# EAGLE design Pyr0-Piezo_Direct_Extruder_Board2.1.2 (EAGLE 9.5.1)
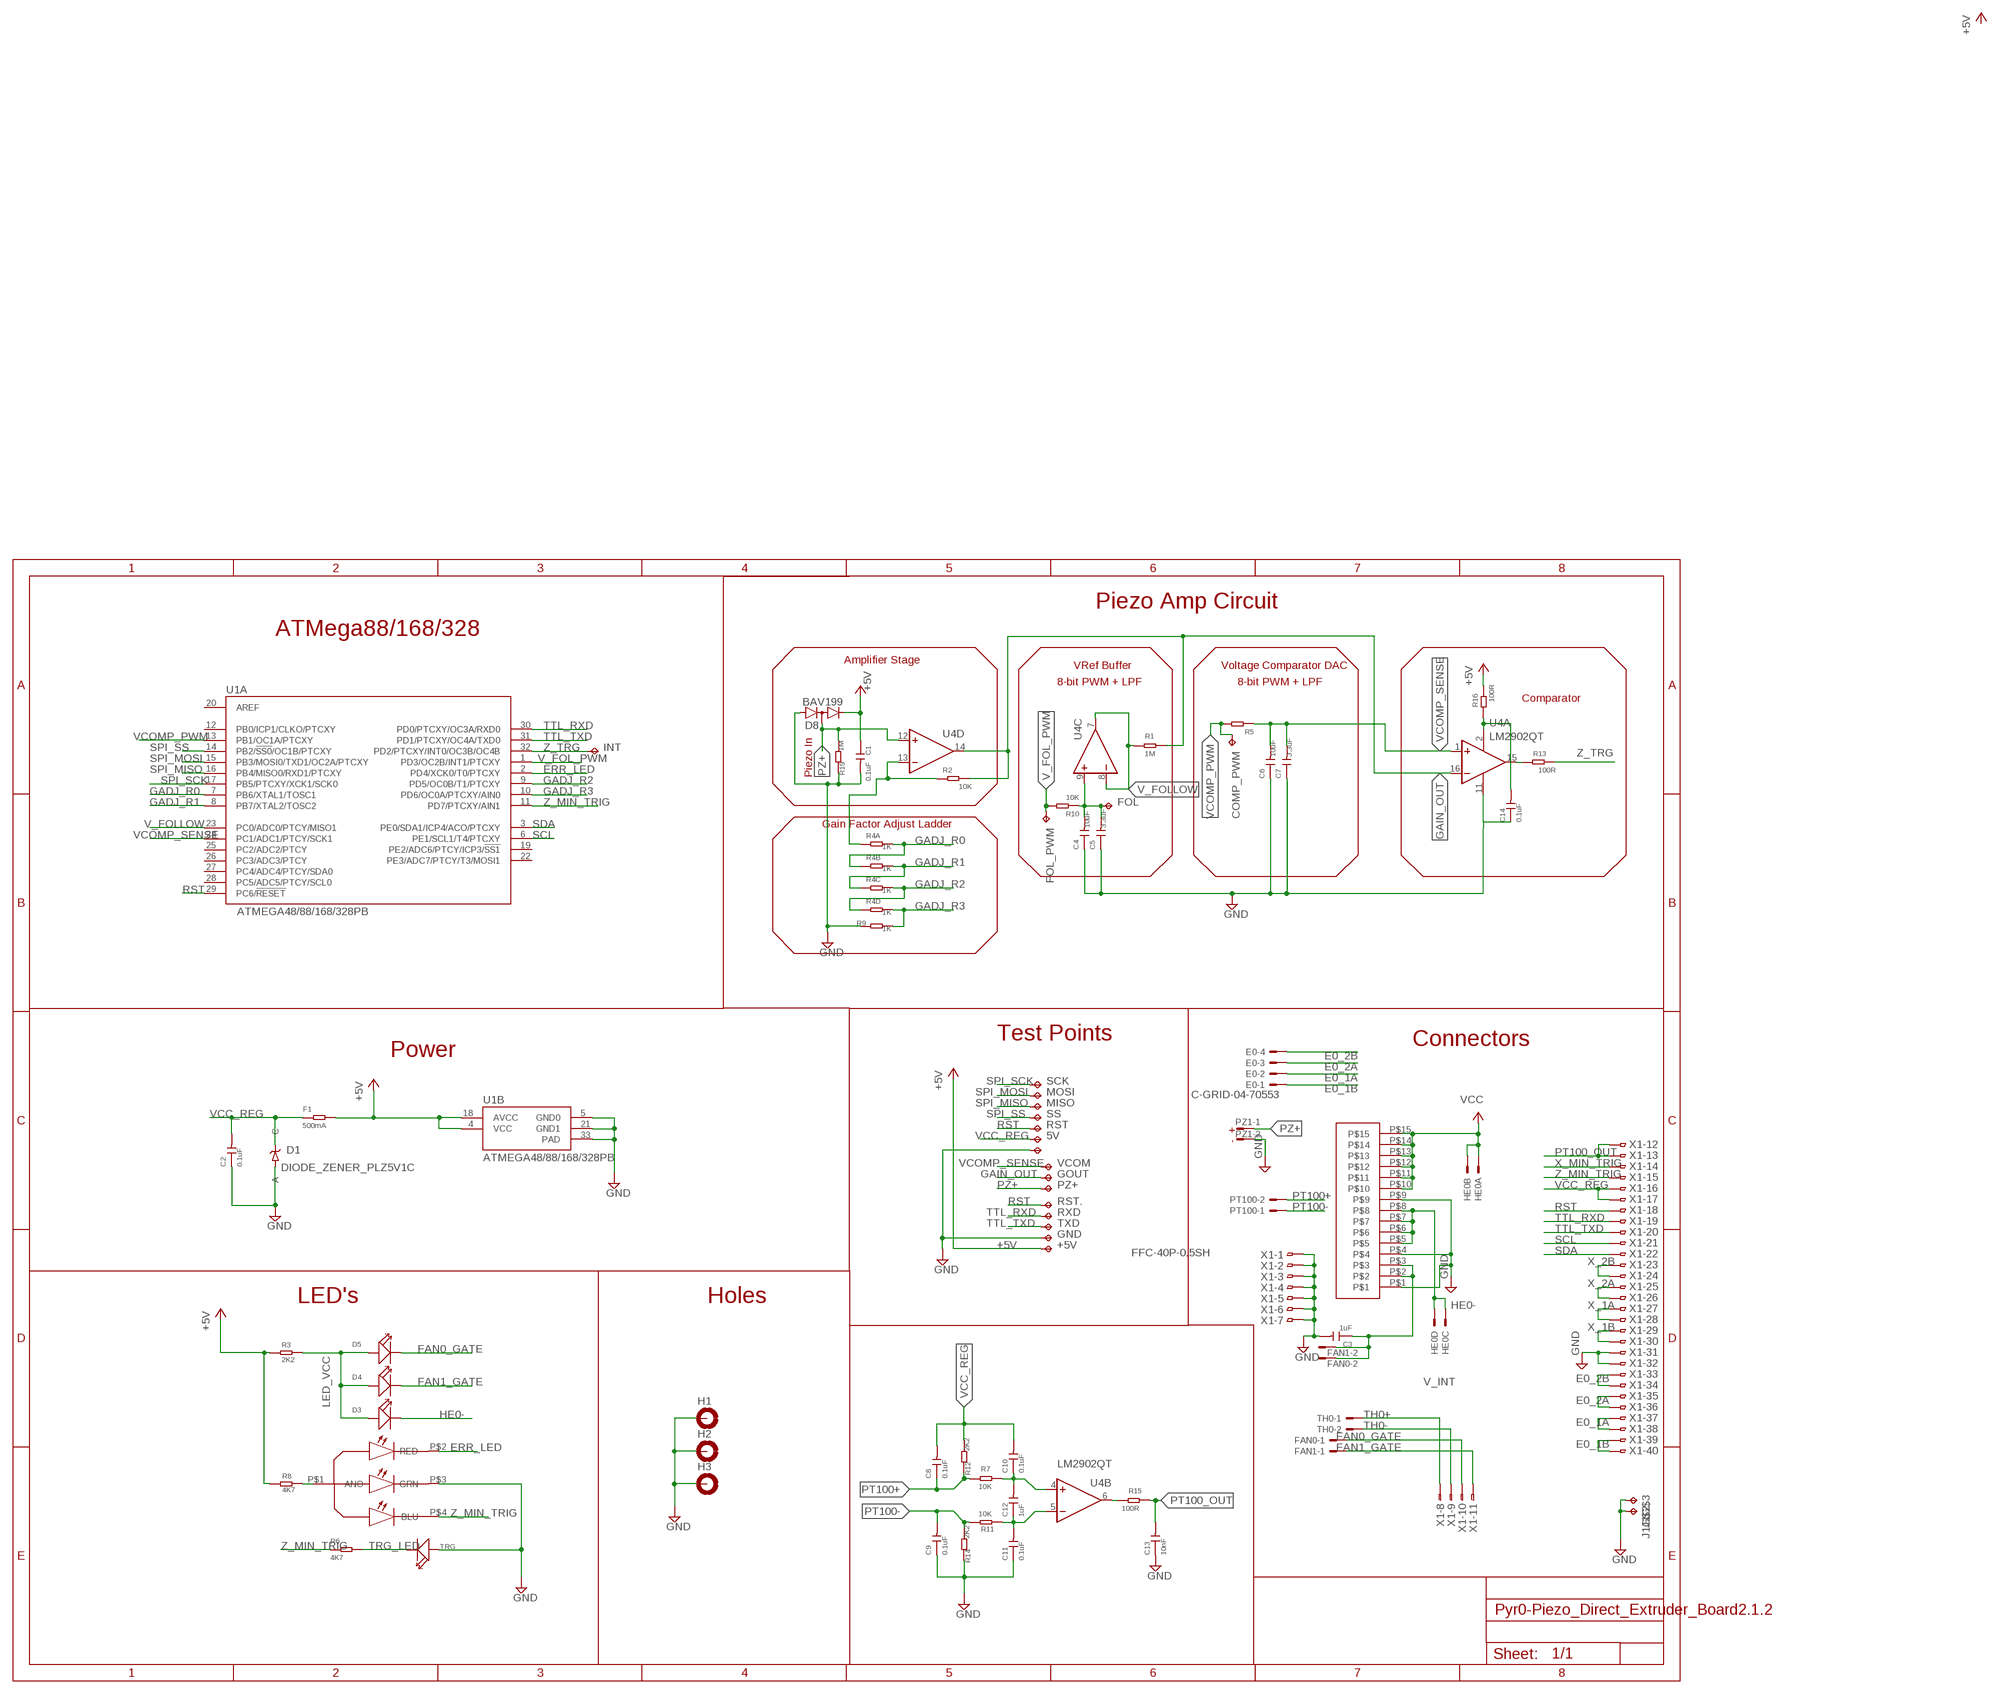
[diagram p0: schematic, sheet 1]

## Parts
5V  TPTP13SQ  [TP13SQ]
+5V  TPTP13SQ  [TP13SQ]
C1  0.1uF  SEEED-CAPACITOR_CERAMIC-10UF-25V-10%-X5R(0805)CAP_0805-3D  [CAPC2012X130]
C2  0.1uF  CERAMIC-1NF-50V-10%-X7R(0402)CAP_0402  [CAPC1005X50]
C3  1uF  SEEED-CAPACITOR_CERAMIC-10UF-25V-10%-X5R(0805)CAP_0603_GEN  [CAPC1609X80]
C4  10uF  CERAMIC-1NF-50V-10%-X7R(0402)CAP_0402  [CAPC1005X50]
C5  3.3uF  SEEED-CAPACITOR_CERAMIC-10UF-25V-10%-X5R(0805)CAP_0603_GEN  [CAPC1609X80]
C6  10uF  CERAMIC-1NF-50V-10%-X7R(0402)CAP_0402  [CAPC1005X50]
C7  3.3uF  SEEED-CAPACITOR_CERAMIC-10UF-25V-10%-X5R(0805)CAP_0603_GEN  [CAPC1609X80]
C8  0.1uF  CERAMIC-1NF-50V-10%-X7R(0402)CAP_0402  [CAPC1005X50]
C9  0.1uF  CERAMIC-1NF-50V-10%-X7R(0402)CAP_0402  [CAPC1005X50]
C10  0.1uF  CERAMIC-1NF-50V-10%-X7R(0402)CAP_0402  [CAPC1005X50]
C11  0.1uF  CERAMIC-1NF-50V-10%-X7R(0402)CAP_0402  [CAPC1005X50]
C12  1uF  CERAMIC-1NF-50V-10%-X7R(0402)CAP_0402  [CAPC1005X50]
C13  10nF  CERAMIC-1NF-50V-10%-X7R(0402)CAP_0402  [CAPC1005X50]
C14  0.1uF  CERAMIC-1NF-50V-10%-X7R(0402)CAP_0402  [CAPC1005X50]
COMP_PWM  TPTP09R  [TP09R]
D1  DIODE_ZENER_PLZ5V1C  [DO-219AC]
D2  LED-RGB-COM_ANO4PLCC  [4PLCC]
D3  SEEED-LED_SMD-LED-CLEAR-BLUE(0603)LED_0603  [SEEED-LED_LED-0603]
D4  SEEED-LED_SMD-LED-CLEAR-BLUE(0603)LED_0603  [SEEED-LED_LED-0603]
D5  SEEED-LED_SMD-LED-CLEAR-BLUE(0603)LED_0603  [SEEED-LED_LED-0603]
D8  BAV199  [SOT23]
E0  C-GRID-04-70553  [70553-04]
F1  500mA  SEEED-RESISTOR_SMD-RES-1.5K-1%-1/10W(0603)DETAILED_MODEL  [SEEED-RESISTOR_R0603]
FAN0  CON-MOLEX-2P-1.27MM048  [53048-02]
FAN1  CON-MOLEX-2P-1.27MM048  [53048-02]
FOL  TPTP13SQ  [TP13SQ]
FOL_PWM  TPTP09R  [TP09R]
GND  TPTP13SQ  [TP13SQ]
GOUT  TPTP13SQ  [TP13SQ]
H1  HOLES_MOUNT-PAD-ROUND3.2  [HOLES_3,2-PAD]
H2  HOLES_MOUNT-PAD-ROUND3.2  [HOLES_3,2-PAD]
H3  HOLES_MOUNT-PAD-ROUND3.2  [HOLES_3,2-PAD]
HE0  JST-2.54-2X2JST-DUPONT-2.54-2X2  [HDRRAR4W64P254_2X2_556X736X556B]
INT  TPTP13R  [TP13R]
J1  FFC-15P-1MM  [FFC-15P-1MM]
MISO  TPTP13SQ  [TP13SQ]
MOSI  TPTP13SQ  [TP13SQ]
PT100  CON-MOLEX-2P-1.27MM048  [53048-02]
PZ1  CON-MOLEX-2P-1.27MM048  [53048-02]
PZ+  TPTP13SQ  [TP13SQ]
R1  1M  SMD-RES-0R-5%-1/16W(0402)  [R0402]
R2  10K  SMD-RES-0R-5%-1/16W(0402)  [R0402]
R3  2K2  SMD-RES-0R-5%-1/16W(0402)  [R0402]
R4  1K  RESISTOR_NETWORK_X40804  [EXBN8V]
R5  0R  SMD-RES-0R-5%-1/16W(0402)  [R0402]
R6  4K7  SMD-RES-0R-5%-1/16W(0402)  [R0402]
R7  10K  SMD-RES-0R-5%-1/16W(0402)  [R0402]
R8  4K7  SMD-RES-0R-5%-1/16W(0402)  [R0402]
R9  1K  SMD-RES-0R-5%-1/16W(0402)  [R0402]
R10  10K  SMD-RES-0R-5%-1/16W(0402)  [R0402]
R11  10K  SMD-RES-0R-5%-1/16W(0402)  [R0402]
R12  2K2  SMD-RES-0R-5%-1/16W(0402)  [R0402]
R13  100R  SMD-RES-0R-5%-1/16W(0402)  [R0402]
R14  2K2  SMD-RES-0R-5%-1/16W(0402)  [R0402]
R15  100R  SMD-RES-0R-5%-1/16W(0402)  [R0402]
R16  100R  SMD-RES-0R-5%-1/16W(0402)  [R0402]
R19  1M  SMD-RES-0R-5%-1/16W(0402)  [R0402]
RST  TPTP13SQ  [TP13SQ]
RST.  TPTP13SQ  [TP13SQ]
RXD  TPTP13SQ  [TP13SQ]
SCK  TPTP13SQ  [TP13SQ]
SS  TPTP06R  [TP06R]
TH0  CON-MOLEX-2P-1.27MM048  [53048-02]
TRG  SEEED-LED_SMD-LED-CLEAR-BLUE(0603)LED_0603  [SEEED-LED_LED-0603]
TXD  TPTP13SQ  [TP13SQ]
U1  ATMEGA48/88/168/328PB  [QFN50P500X500X90-33N]
U4  LM2902QT  [QFN16]
VCOM  TPTP13SQ  [TP13SQ]
X1  FFC-40P-0.5SH  [FH12-40S-0.5SH]
⏚  TPTP13SQ  [TP13SQ]

## Nets
+5V [Power]: +5V.TP C1.1 D8.2(C) F1.2 R3.1 R8.1 R16.2 U1.4(B:VCC) U1.18(B:AVCC)
COMP_VCC: C14.2 R16.1 U4.2(P:V+)
E0_1A: E0.2 X1.37 X1.38
E0_1B: E0.1 X1.39 X1.40
E0_2A: E0.3 X1.35 X1.36
E0_2B: E0.4 X1.33 X1.34
ERR_LED: D2.P$2(RED) U1.2(A:PD4/XCK0/T0/PTCXY)
FAN0_GATE [Power]: D5.- FAN0.1 X1.10
FAN1_GATE [Power]: D4.- FAN1.1 X1.11
GADJ_R0: R4.2 R4.8 U1.7(A:PB6/XTAL1/TOSC1)
GADJ_R1: R4.3 R4.7 U1.8(A:PB7/XTAL2/TOSC2)
GADJ_R2: R4.4 R4.6 U1.9(A:PD5/OC0B/T1/PTCXY)
GADJ_R3: R4.5 R9.2 U1.10(A:PD6/OC0A/PTCXY/AIN0)
GAIN_FB: R2.1 R4.1 U4.13(D:-IN)
GAIN_OUT: GOUT.TP R1.2 R2.2 U4.14(D:OUT) U4.16(A:-IN)
GND [Power]: C1.2 C2.1 C3.2 C4.1 C5.1 C6.1 C7.1 C9.1 C11.1 C13.1 C14.1 D1.P$1(A) D2.P$3(GRN) D8.1(A) GND.TP H1.B3,2(MOUNT) H2.B3,2(MOUNT) H3.B3,2(MOUNT) J1.P$1 J1.P$4 J1.P$9 J1.P$16(TP) J1.P$17(TP) PZ1.2 R9.1 R14.1 R19.1 TRG.+ U1.5(B:GND0) U1.21(B:GND1) U1.33(B:PAD) U4.11(P:V-) X1.1 X1.2 X1.3 X1.4 X1.5 X1.6 X1.7 X1.31 X1.32 ⏚.TP
HE0-: D3.- HE0.3 HE0.4 J1.P$5 J1.P$6 J1.P$7 J1.P$8
LED_VCC: D3.+ D4.+ D5.+ R3.2
PT100+: C8.1 PT100.2 R7.2 R12.1
PT100-: C9.2 PT100.1 R11.2 R14.2
PT100_AMP+: C10.1 C12.2 R7.1 U4.4(B:+IN)
PT100_AMP-: C11.2 C12.1 R11.1 U4.5(B:-IN)
PT100_OUT: C13.2 R15.1 X1.12 X1.13
PT100_R: R15.2 U4.6(B:OUT)
PZ+: D8.3(AC) PZ1.1 PZ+.TP R19.2 U4.12(D:+IN)
PZ_AMP_OUT: R13.1 U4.15(A:OUT)
RGB_VCC: D2.P$1(ANO) R8.2
RST: RST..TP RST.TP U1.29(A:PC6/!RESET!) X1.18
SCL: U1.6(A:PE1/SCL1/T4/PTCXY) X1.21
SDA: U1.3(A:PE0/SDA1/ICP4/ACO/PTCXY) X1.22
SPI_MISO: MISO.TP U1.16(A:PB4/MISO0/RXD1/PTCXY)
SPI_MOSI: MOSI.TP U1.15(A:PB3/MOSI0/TXD1/OC2A/PTCXY)
SPI_SCK: SCK.TP U1.17(A:PB5/PTCXY/XCK1/SCK0)
SPI_SS: SS.TP U1.14(A:PB2/!SS0!/OC1B/PTCXY)
TH0+: TH0.1 X1.8
TH0-: TH0.2 X1.9
TRG_LED: R6.2 TRG.-
TTL_RXD: RXD.TP U1.30(A:PD0/PTCXY/OC3A/RXD0) X1.19
TTL_TXD: TXD.TP U1.31(A:PD1/PTCXY/OC4A/TXD0) X1.20
V_FOL_PWM: FOL_PWM.TP R10.2 U1.1(A:PD3/OC2B/INT1/PTCXY)
V_FOLLOW: R1.1 U1.23(A:PC0/ADC0/PTCY/MISO1) U4.7(C:OUT) U4.8(C:-IN)
V_INT [Power]: C3.1 FAN0.2 FAN1.2 J1.P$2 J1.P$3
VCC [Power]: HE0.1 HE0.2 J1.P$10 J1.P$11 J1.P$12 J1.P$13 J1.P$14 J1.P$15
VCC_REG [Power]: 5V.TP C2.2 C8.2 C10.2 D1.P$2(C) F1.1 R12.2 X1.16 X1.17
VCOMP_PWM: COMP_PWM.TP R5.2 U1.13(A:PB1/OC1A/PTCXY)
VCOMP_SENSE: C6.2 C7.2 R5.1 U1.24(A:PC1/ADC1/PTCY/SCK1) U4.1(A:+IN) VCOM.TP
VREF_IN: C4.2 C5.2 FOL.TP R10.1 U4.9(C:+IN)
X_1A [Power]: X1.27 X1.28
X_1B [Power]: X1.29 X1.30
X_2A [Power]: X1.25 X1.26
X_2B [Power]: X1.23 X1.24
X_MIN_TRIG: X1.14
Z_MIN_TRIG: D2.P$4(BLU) R6.1 U1.11(A:PD7/PTCXY/AIN1) X1.15
Z_TRG: INT.TP R13.2 U1.32(A:PD2/PTCXY/INT0/OC3B/OC4B)
Unconnected: U1.12(A:PB0/ICP1/CLKO/PTCXY) U1.19(A:PE2/ADC6/PTCY/ICP3/!SS1!) U1.20(A:AREF) U1.22(A:PE3/ADC7/PTCY/T3/MOSI1) U1.25(A:PC2/ADC2/PTCY) U1.26(A:PC3/ADC3/PTCY) U1.27(A:PC4/ADC4/PTCY/SDA0) U1.28(A:PC5/ADC5/PTCY/SCL0)

## Notes on the sheet
- Piezo Amp Circuit
- ATMega88/168/328
- Amplifier Stage
- VRef Buffer | Voltage Comparator DAC
- 8-bit PWM + LPF | 8-bit PWM + LPF
- Comparator
- Piezo In
- Gain Factor Adjust Ladder
- Test Points | Connectors
- Power
- -  +
- LED's | Holes

## Library data of the parts
5V COMP_PWM FOL FOL_PWM GOUT INT MISO MOSI PZ+ RST SCK VCOM = PiezoFFC:TP: Test pad
+5V GND RST. RXD SS TXD ⏚ = testpad:TP: Test pad
C1 C3 C5 C7 = PiezoFFC:SEEED-CAPACITOR_CERAMIC-10UF-25V-10%-X5R(0805): 302010178
C2 C4 C6 C8-C14 = PiezoFFC:CERAMIC-1NF-50V-10%-X7R(0402): 302010005
D1 = PiezoFFC:DIODE_ZENER_PLZ5V1C
D2 = PiezoFFC:LED-RGB-COM_ANO: Everlight Electronics Co Ltd EAST1616RGBB4 0606 RGB LED Color: RGB Lens Transparency: Clear Lens Style/Size: Rectangle with Flat top, 1.10 x 1.5 mm mC Rating45mcd Red, 35 mcd Green Current: 5mA Red, 5mA Green, 5mA Forward Voltage: 2V Red, 2V Green Packages: 0606 SparkFun Products: Electric Imp imp002 Breakout <[https://www.sparkfun.com/products/12958]>
D3-D5 TRG = PiezoFFC:SEEED-LED_SMD-LED-CLEAR-BLUE(0603): 304090045
D8 = PiezoFFC:BAV199: DIODE low-leakage double diode
E0 = PiezoFFC:C-GRID-04: CONNECTOR wire to board 2.54 mm (0.100") pitch header; MF: MOLEX; OC_FARNELL: unknown; OC_NEWARK: unknown
F1 = PiezoFFC:SEEED-RESISTOR_SMD-RES-1.5K-1%-1/10W(0603): 301010189
FAN0 FAN1 PT100 PZ1 TH0 = PiezoFFC:CON-MOLEX-2P-1.27MM: CONNECTOR wire to board 1.25 mm (.049 inch) pitch header; MF: MOLEX; MPN: 53048-0210; OC_FARNELL: 1012259; OC_NEWARK: 57H4718
H1-H3 = PiezoFFC:HOLES_MOUNT-PAD-ROUND: MOUNTING PAD, round
HE0 = PiezoFFC:JST-2.54-2X2
J1 = PiezoFFC:FFC-15P-1MM
R1-R3 R6-R16 R19 = PiezoFFC:SMD-RES-0R-5%-1/16W(0402): 301010000; MPN: RC0402JR-070RL; VALUE: 0R
R4 = PiezoFFC:RESISTOR_NETWORK_X4
R5 = PiezoFFC:SMD-RES-0R-5%-1/16W(0402): 301010000; MPN: RC0402JR-070RL
U1 = PiezoFFC:ATMEGA48/88/168/328PB: AVR 32KBytes Flash, 1KBytes EEPROM, 2KBytes RAM, w - 20MHZ, QFN/MFL, IND TEMP, GREEN 5 V/ DFN/QFN (M); AVAILABILITY: Unavailable; DESCRIPTION: AVR 32KBytes Flash, 1KBytes EEPROM, 2KBytes RAM, w - 20MHZ, QFN/MFL, IND TEMP, GREEN 5 V/ DFN/QFN _M_; MF: Microchip; MP: ATMEGA328PB-MU; PACKAGE: VFQFN-32 Microchip; PRICE: None
U4 = PiezoFFC:LM2902: Low power quad operational amplifier Source: Data sgeet <http://www.st.com/internet/com/TECHNICAL_RESOURCES/TECHNICAL_LITERATURE/DATASHEET/CD00000533.pdf>
X1 = PiezoFFC:FFC-40P-0.5S: 0.5mm Pitch Connectors For FPC/FFC Source: Data sheet <http://www.hirose.co.jp/cataloge_hp/e58605370.pdf>; MPN: FH12-40S-0.5SH(55); OC_FARNELL: 1324556; OC_NEWARK: 34M6178

## Board
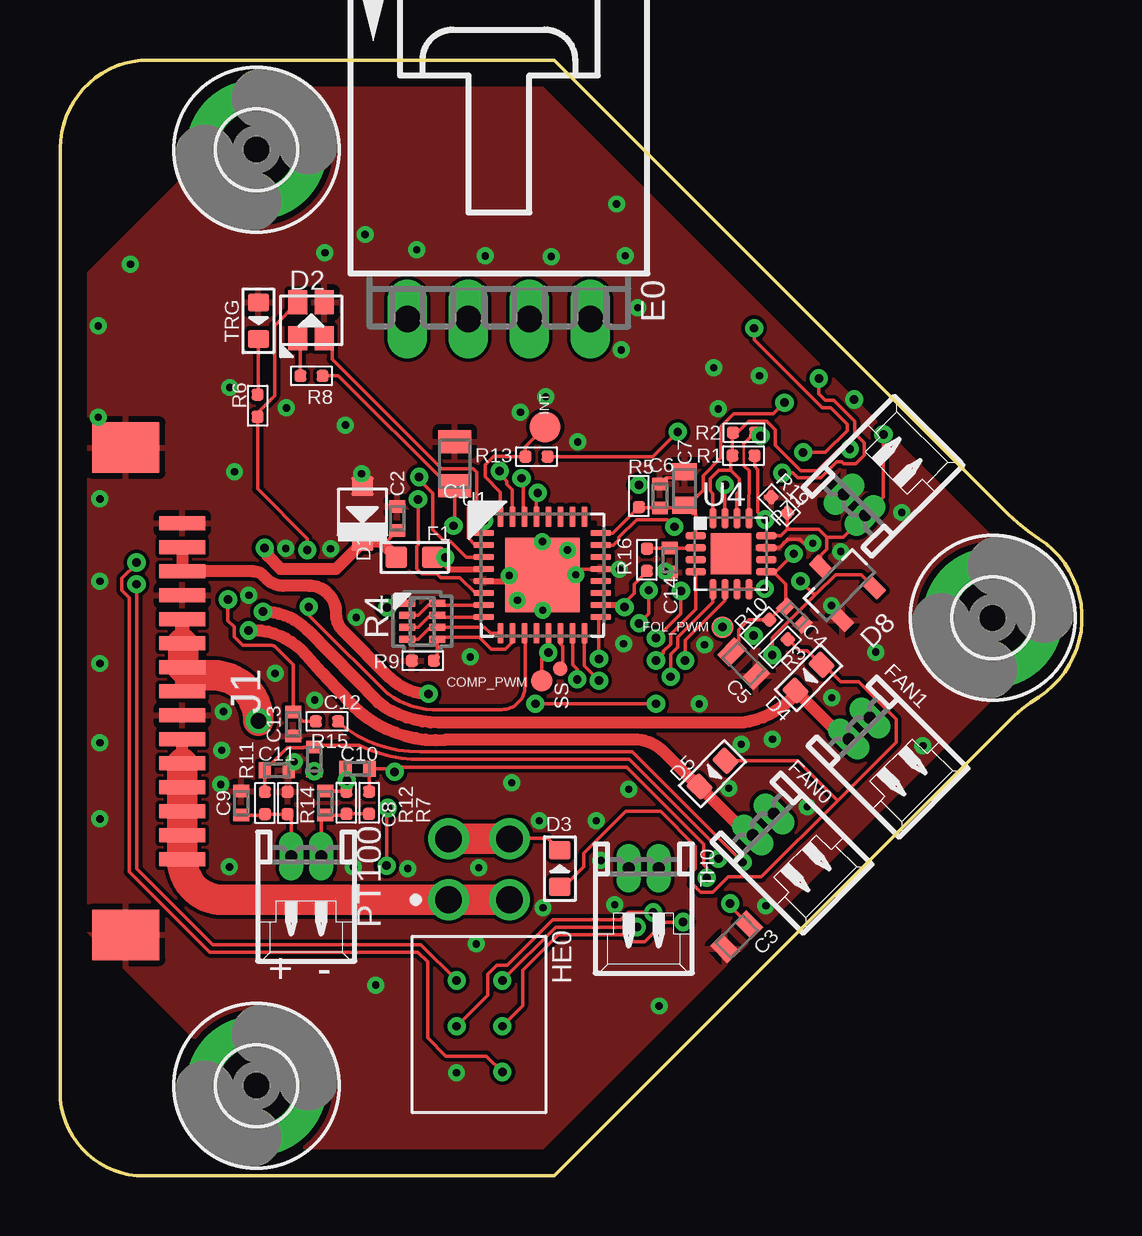
[diagram p1: board, top side]
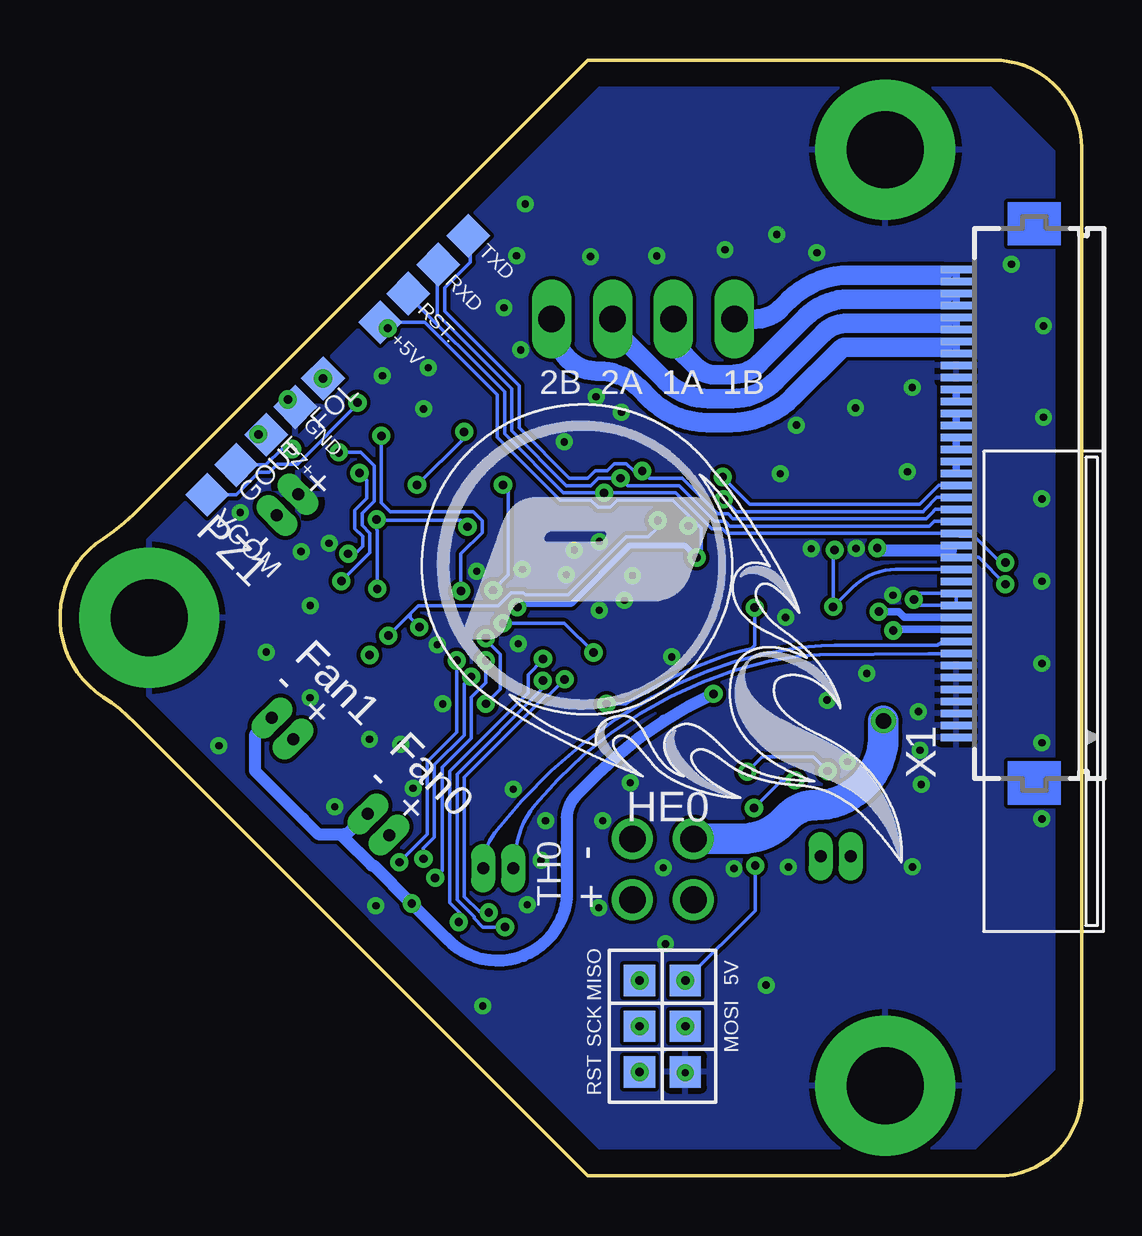
[diagram p2: board, bottom side, seen from below]

Size 42.58 x 46.48 mm. Coordinates in mm from the lower left corner, seen from the top.
Outline: 22.46,1.87 39.46,18.87 arc-12 40.78,19.94 arc114 40.78,26.54 arc-12 39.51,27.56 20.59,46.48 8.14,46.48 3.7,46.48 arc90 0.01,42.8 0.01,3.81 arc90 3.19,0 8.27,0 20.59,0 22.46,1.87
Copper layers (1*16): Top 0.035mm / dielectric 1.5mm / Bottom 0.035mm
Design rules "default *": minimum track width 6mil, minimum drill 0.35mm, track to track 6mil, track to pad 6mil, pad to pad 6mil, via to via 6mil, smd to smd 6mil, copper to edge 40mil, drill to drill 6mil, minimum pad ring 10mil, minimum via ring 8mil, stop-mask expansion 4mil, vias tented up to drill 4mm, thermal gap 10mil

### Footprints (pad centres in the part's own frame; a part is rotated, then mirrored left to right if it is on the bottom)
TP13SQ = smd 1.3 x 1.3: TP 0,0
CAPC2012X130 = smd 0.962 x 1.362: 1 -0.925,0; 2 0.925,0
CAPC1005X50 = smd 0.512 x 0.662: 1 -0.5,0; 2 0.5,0
CAPC1609X80 = smd 0.712 x 1.012: 1 -0.7,0; 2 0.7,0
TP09R = smd 0.9 x 0.9: TP 0,0
DO-219AC = smd 0.8 x 0.9: P$1 -1.15,0; P$2 1.15,0
4PLCC = smd 1 x 0.8: P$1 -0.75,0.55; P$2 -0.75,-0.55; P$3 0.75,-0.55; P$4 0.75,0.55
SEEED-LED_LED-0603 = smd 0.762 x 0.889: + -0.762,0; - 0.762,0
SOT23 = smd 0.6 x 0.9: 1 -0.95,-1.1; 2 0.95,-1.1; 3 0,1.1
70553-04 = drill 1.092 long: 1 -3.81,-7.62; 2 -1.27,-7.62; 3 1.27,-7.62; 4 3.81,-7.62
SEEED-RESISTOR_R0603 = smd 0.889 x 0.889: 1 0,0.762; 2 0,-0.762
53048-02 = drill 0.5 pad 0.698 long: 1 0.625,-1.25; 2 -0.625,-1.25
HOLES_3,2-PAD = drill 3.2 pad 5.842: B3,2 0,0
HDRRAR4W64P254_2X2_556X736X556B = drill 1.105 pad 1.705: 1 0,0; 2 2.54,0; 3 2.54,2.54; 4 0,2.54
TP13R = smd 1.3 x 1.3: TP 0,0
FFC-15P-1MM = smd 0.6 x 1.9: P$1 0,0; P$2 1,0; P$3 2,0; P$4 3,0; P$5 4,0; P$6 5,0; P$7 6,0; P$8 7,0; P$9 8,0; P$10 9,0; P$11 10,0; P$12 11,0; P$13 12,0; P$14 13,0; P$15 14,0 | smd 2.1 x 2.8: P$16 -3.15,-2.35; P$17 17.15,-2.35
R0402 = smd 0.5 x 0.5: 1 0,0.463; 2 0,-0.463
EXBN8V = smd 0.657 x 0.3: 1 -0.629,0.75; 2 -0.629,0.25; 3 -0.629,-0.25; 4 -0.629,-0.75; 5 0.629,-0.75; 6 0.629,-0.25; 7 0.629,0.25; 8 0.629,0.75
TP06R = smd 0.6 x 0.6: TP 0,0
QFN50P500X500X90-33N = smd 0.86 x 0.26: 1 -2.435,1.75; 2 -2.435,1.25; 3 -2.435,0.75; 4 -2.435,0.25; 5 -2.435,-0.25; 6 -2.435,-0.75; 7 -2.435,-1.25; 8 -2.435,-1.75; 17 2.435,-1.75; 18 2.435,-1.25; 19 2.435,-0.75; 20 2.435,-0.25; 21 2.435,0.25; 22 2.435,0.75; 23 2.435,1.25; 24 2.435,1.75 | smd 0.26 x 0.86: 9 -1.75,-2.435; 10 -1.25,-2.435; 11 -0.75,-2.435; 12 -0.25,-2.435; 13 0.25,-2.435; 14 0.75,-2.435; 15 1.25,-2.435; 16 1.75,-2.435; 25 1.75,2.435; 26 1.25,2.435; 27 0.75,2.435; 28 0.25,2.435; 29 -0.25,2.435; 30 -0.75,2.435; 31 -1.25,2.435; 32 -1.75,2.435 | smd 3.1 x 3.1: 33 0,0
QFN16 = smd 0.85 x 0.3: 1 -1.475,0.75; 2 -1.475,0.25; 3 -1.475,-0.25; 4 -1.475,-0.75; 9 1.475,-0.75; 10 1.475,-0.25; 11 1.475,0.25; 12 1.475,0.75 | smd 0.3 x 0.85: 5 -0.75,-1.475; 6 -0.25,-1.475; 7 0.25,-1.475; 8 0.75,-1.475; 13 0.75,1.475; 14 0.25,1.475; 15 -0.25,1.475; 16 -0.75,1.475 | smd 1.7 x 1.7: TH 0,0
FH12-40S-0.5SH = smd 0.3 x 1.3: 1 -9.75,3.25; 2 -9.25,3.25; 3 -8.75,3.25; 4 -8.25,3.25; 5 -7.75,3.25; 6 -7.25,3.25; 7 -6.75,3.25; 8 -6.25,3.25; 9 -5.75,3.25; 10 -5.25,3.25; 11 -4.75,3.25; 12 -4.25,3.25; 13 -3.75,3.25; 14 -3.25,3.25; 15 -2.75,3.25; 16 -2.25,3.25; 17 -1.75,3.25; 18 -1.25,3.25; 19 -0.75,3.25; 20 -0.25,3.25; 21 0.25,3.25; 22 0.75,3.25; 23 1.25,3.25; 24 1.75,3.25; 25 2.25,3.25; 26 2.75,3.25; 27 3.25,3.25; 28 3.75,3.25; 29 4.25,3.25; 30 4.75,3.25; 31 5.25,3.25; 32 5.75,3.25; 33 6.25,3.25; 34 6.75,3.25; 35 7.25,3.25; 36 7.75,3.25; 37 8.25,3.25; 38 8.75,3.25; 39 9.25,3.25; 40 9.75,3.25

### Placement (x,y rotation side)
5V  16.52,8.13 0 bottom
+5V  29.24,35.56 135 bottom
C1  16.45,29.66 90 top
C2  14.06,27.38 270 top
C3  28.2,9.96 225 top
C4  30.6,23.34 135 top
C5  28.49,21.32 135 top
C6  25,28.32 270 top
C7  26.02,28.62 270 top
C8  11.05,15.52 90 top
C9  7.56,15.52 270 top
C10  12.39,16.95 180 top
C11  9.03,16.89 180 top
C12  10.59,17.35 270 top
C13  9.72,18.82 90 top
C14  25.41,25.65 90 top
COMP_PWM  20.08,20.61 0 top
D1  12.6,27.58 270 top
D2  10.46,35.63 90 top
D3  20.83,12.79 90 top
D4  31.19,20.75 225 top
D5  27.19,16.75 225 top
D8  32.48,24.6 45 top
E0  18.29,43.31 0 top
F1  14.77,25.75 90 top
FAN0  30.19,13.75 225 top
FAN1  34.19,17.75 225 top
FOL  31.62,33.21 225 bottom
FOL_PWM  27.6,22.85 0 top
GND  32.78,32.02 315 bottom
GOUT  35.23,29.61 225 bottom
H1  8.19,3.75 0 top
H2  8.19,42.75 0 top
H3  38.86,23.24 0 top
HE0  16.19,11.49 0 top
INT  20.21,31.19 180 top
J1  5.09,27.18 270 top
MISO  18.43,8.13 0 bottom
MOSI  16.52,6.22 0 bottom
PT100  10.26,12.06 180 top
PZ1  33.99,28.83 315 top
PZ+  33.99,30.86 45 bottom
R1  28.48,30 270 top
R2  28.5,30.95 270 top
R3  30.01,22.02 135 top
R4  15.09,23.09 0 top
R5  24.12,28.32 180 top
R6  8.23,32.08 180 top
R7  12.88,15.53 0 top
R8  10.48,33.32 270 top
R9  15.12,21.46 90 top
R10  29.23,22.83 315 top
R11  8.53,15.52 0 top
R12  11.93,15.53 180 top
R13  19.86,29.96 270 top
R14  9.48,15.52 0 top
R15  11.13,18.92 90 top
R16  24.45,25.66 0 top
R19  29.96,27.94 45 top
RST  18.43,4.32 0 bottom
RST.  28.07,36.75 315 bottom
RXD  26.82,37.96 135 bottom
SCK  18.43,6.22 0 bottom
SS  20.84,21.11 90 top
TH0  24.32,11.56 180 top
TRG  8.27,35.62 270 top
TXD  25.57,39.16 135 bottom
U1  20.1,25.02 0 top
U4  27.95,25.91 0 top
U$1  [LOGO-PYR0BALL-SS-20MM]  20.73,25.51 0 bottom
VCOM  36.45,28.36 45 bottom
X1  1.98,28 90 bottom
⏚  16.52,4.32 0 bottom

### Tracks (layer width: path | path; a pad name or v marks a point on that pad's centre or on a via)
+5V  (via drill 0.35)
  Top 0.15: 29.68,22.41 31.44,24.18
  Top 0.152: 29.68,22.41 R3.1 | D8.2 33.38,25.04 32.33,25.04 31.54,24.25 31.51,24.25 31.44,24.18 v30.85,24.77 | v28.92,35.31 28.92,34.83 31.76,32 32.12,32 32.8,31.31 32.8,31.04 31.89,30.13 v30.96,30.13 | 23.43,23.77 23.92,24.27 23.92,24.64 24.45,25.17 R16.2 | v16.4,27.08 16.45,27.13 C1.1 16.19,28.73 11.6,33.32 R8.1
  Top 0.254: F1.2 15.56,25.73 15.81,25.73 | 15.81,25.73 16.27,25.27 U1.4 | v23.52,23.68 23.43,23.77 U1.18 | v16.05,25.75 16.03,25.73 15.81,25.73
  Bottom 0.152: +5V.TP 28.99,35.31 v28.92,35.31 28.67,35.56 27.39,35.56 24.36,32.53 24.36,30.77 21.73,28.14 20.46,28.14 20.16,27.84 19.65,27.84 19.35,28.14 17.04,28.14 16.3,27.4 | v16.05,25.75 15.86,25.95 15.86,26.96 16.3,27.4 | v16.4,27.08 16.3,27.18 16.3,27.4 | v30.96,30.13 30.05,30.13 29.49,29.57 29.49,28.09 29.99,27.59 29.99,27.09 29.66,26.76 29.66,25.96 v30.85,24.77
  Bottom 0.254: v23.52,23.68 23.37,23.84 21.25,23.84 18.83,26.26 16.55,26.26 v16.05,25.75
  other vias: 29.68,21.69
COMP_VCC
  Top 0.152: U4.2 26.47,26.15 C14.2 24.48,26.15 R16.1
E0_1A
  Bottom 0.305: X1.37 X1.38 arc45 5.79,36.52 5.86,36.52
  Bottom 0.813: E0.2 17.02,35.35 arc-45 16.52,34.16 16.02,33.65 arc-45 15.34,33.37 14.61,33.37 arc-45 13.41,33.87 11.5,35.78 arc45 9.71,36.52 5.86,36.52
E0_1B
  Bottom 0.305: X1.39 X1.40 arc45 5.79,37.52 5.86,37.52
  Bottom 0.813: E0.1 13.61,35.69 arc-45 12.56,36.12 12.22,36.47 arc45 9.67,37.52 5.86,37.52
E0_2A
  Bottom 0.305: X1.35 X1.36 arc45 5.79,35.52 5.81,35.52
  Bottom 0.813: E0.3 arc-45 19.3,35.06 17.35,33.12 arc-45 15.56,32.37 14.56,32.37 arc-45 12.77,33.12 10.78,35.1 arc45 9.76,35.52 5.81,35.52
E0_2B
  Bottom 0.305: X1.33 X1.34 arc45 5.79,34.52 5.81,34.52
  Bottom 0.813: E0.4 E0.4 arc-45 21.41,34.02 arc-45 20.2,33.52 20.16,33.52 arc45 18.45,32.82 18.01,32.37 arc-45 15.6,31.37 14.62,31.37 arc-45 12.04,32.44 10.07,34.41 arc45 9.81,34.52 5.81,34.52
ERR_LED
  Top 0.152: U1.2 17.3,26.27 17.01,26.57 17.01,27.8 17.36,28.16 17.36,29.31 17.23,29.44 15.91,29.44 11.33,34.02 11.33,34.56 D2.P$2
FAN0_GATE  (via drill 0.35)
  Top 0.508: FAN0.1 28.67,14.19 D5.- 26.18,16.64 25.16,17.65 arc50 23.76,18.16 16.08,18.16 arc-49 12.2,19.59 arc-5 10.25,21.69 arc41 8.4,22.71 v7.86,22.71
  Bottom 0.305: v7.86,22.71 7.66,22.71 7.61,22.75 X1.10
FAN1_GATE  (via drill 0.35)
  Top 0.508: FAN1.1 32.67,18.19 D4.- 30.65,20.06 30.46,19.87 arc-37 28.46,18.87 15.77,18.87 arc-37 13.26,19.71 arc1 10.3,22.74 arc45 v8.46,23.5
  Bottom 0.305: v8.46,23.5 7.63,23.5 7.39,23.25 X1.11
GADJ_R0
  Top 0.152: R4.2 14.92,23.34 15.36,23.78 15.66,23.78 R4.8 15.79,23.77 U1.7
GADJ_R1
  Top 0.152: R4.3 14.92,22.84 15.36,23.28 15.66,23.28 R4.7 15.79,23.41 15.92,23.27 U1.8
GADJ_R2
  Top 0.152: R4.4 14.92,22.34 15.36,22.78 15.66,22.78 R4.6 17.69,22.84 17.94,22.59 U1.9
GADJ_R3
  Top 0.152: R9.2 15.72,21.6 R4.5 15.8,22.42 17.47,22.42 17.96,21.93 18.56,21.93 18.85,22.22 U1.10
GAIN_FB  (via drill 0.35)
  Top 0.102: 28.48,29.58 28.48,30.48
  Top 0.152: R4.1 14.4,23.78 13.75,23.78 v13.63,23.66 | U4.13 28.71,29.36 28.48,29.58 | v25.87,24.36 25.87,23.42 24.85,22.39 v24.83,22.39 | v24.83,19.66 v19.81,19.66 | 28.48,30.48 R2.1 29.06,30.95 v29.19,30.82
  Bottom 0.152: v25.87,24.36 25.87,25.9 24.99,26.78 24.99,27.29 25.37,27.66 28.81,27.66 29.19,28.04 v29.19,30.82 | v24.83,22.39 24.83,22.32 24.23,21.71 24.23,20.26 v24.83,19.66 | v19.81,19.66 19.03,19.66 18.92,19.72 18.89,19.75 17.83,20.35 arc9 15.14,21.56 arc8 13.78,21.95 13.63,22.1 v13.63,23.66
GAIN_OUT  (via drill 0.35)
  Top 0.152: 27.96,29.38 27.45,29.38 27.1,29.03 27.1,28.53 27.2,28.42 U4.16 | 27.96,29.38 28.31,29.03 28.31,28.53 28.2,28.42 U4.14 | 27.96,29.38 27.96,29.94 R1.2 28.02,30.93 R2.2 28.21,30.95 28.69,31.43 29.44,31.43 29.79,31.07 29.79,30.44 30.86,29.37 31.56,29.37 32.46,30.27 v32.9,30.27
  Bottom 0.152: v32.9,30.27 33.33,30.27 34,29.61 GOUT.TP
GND  (via drill 0.3, 0.35)
  Top 0.152: U4.11 29.97,26.16 30.32,26.52 30.82,26.52 30.99,26.35 v31.37,26.35 | C7.1 25.78,29.08 25.26,29.08 C6.1 | U1.33 20.35,25.27 U1.21
  Top 0.254: U1.5 19.56,24.77 19.7,24.64 19.71,24.64 U1.33
  other vias: 23.48,22.17 27.43,31.94 23.56,38.33 8.96,20.92 25.21,25.18 35.96,17.91 29.68,18.18 2.94,37.97 35.07,27.63 1.67,28.19 1.67,24.77 1.67,21.34 1.67,18.03 1.67,14.86 13.16,7.94 6.75,17.72 7.87,24.18 11.04,38.45 11.27,26.12 20.24,32.45 19.97,14.78 21.57,30.57 22.35,14.78 14.87,38.58 28.38,17.97 19.06,23.98 31.13,15.37 29.41,11.24 27.87,16.14 12.23,12.86 17.44,12.83 32.54,26 20.47,38.29 27.24,33.65 29.14,33.32 12.56,29.25 32.16,19.91 7.07,32.84 7.27,29.33 33.09,32.33 19.19,31.81 20.11,23.56 32.15,23.75 12.35,23.26 18.72,25 21.49,25.04 21.15,26.06 26.64,19.65 9.41,26.13 26.86,22.12 11.89,31.27 17.09,21.61 23.7,16.1 6.69,16.3 7.06,12.86 17.71,38.32 23.19,40.48 12.71,39.21 33.98,21.81 6.81,19.34 10.62,19.81 24.08,36.16 23.39,34.4 1.6,31.59 1.6,35.4 16.52,4.29 17.35,9.65 22.54,13.13 23.11,11.29 20.12,11.16 18.82,16.37 24.96,7.07 14.49,12.79 20.1,26.42 9.43,31.98 9.77,17.24 23.31,25.26
  pour Top (rank 6): 1.01,37.43 1.01,10.32 10.46,0.87 20.46,0.87 39.46,19.87 39.46,26.87 20.46,45.87 9.46,45.87
  pour Bottom (rank 6): 1.01,42.51 1.01,4.6 4.47,1.14 20.08,1.14 39.26,20.32 39.26,26.16 20.08,45.34 3.84,45.34
  cutout Top: 18.06,27.22 22.31,27.22 22.31,23.07 22.31,22.8 18.18,22.8 17.86,22.8 17.86,27.22
HE0-  (via drill 0.65)
  Top 0.152: D3.- 20.32,14.06 18.76,14.06 HE0.3
  Top 0.61: J1.P$6 J1.P$5 | J1.P$7 J1.P$8
  Top 1.27: HE0.3 HE0.4 | v8.27,18.95 arc90 6.37,20.85 5.43,20.85 5.13,21.15 | 5.13,21.15 J1.P$7 | J1.P$6 5.13,22.15 5.13,21.15
  Bottom 1.27: HE0.4 14.21,14.03 arc-45 12.42,14.78 12.21,14.98 arc45 11.13,15.43 arc-90 8.27,18.29 v8.27,18.95
LED_VCC
  Top 0.152: D5.+ 30.74,17.29 32.4,15.62 | 32.4,15.62 34.84,18.06 34.84,19.02 33.28,20.57 32.53,20.57 31.82,21.29 D4.+ 31.14,21.87 30.81,21.87 R3.2 | 32.4,15.62 29.22,12.45 27.85,12.45 27.2,11.8 26.7,11.8 26.34,12.15 26.34,12.65 26.47,12.79 26.47,13.73 25.02,15.18 23.57,15.18 21.83,13.43 21.83,12.86 21,12.03 D3.+
PT100+
  Top 0.152: R7.2 R12.1 11.87,15.02 C8.1 11.02,15.05 10.88,14.91 PT100.2
PT100-
  Top 0.152: C9.2 8.49,15.02 R11.2 R14.2 9.63,14.91 PT100.1
PT100_AMP+  (via drill 0.35)
  Top 0.152: v26.95,12.4 26.95,12.83 26.83,12.95 26.83,13.81 23.61,17.02 14.14,17.02 v13.95,16.82 13.82,16.95 C10.1 12.89,16.01 R7.1 | U4.4 26.48,23.59 25.44,22.55 25.44,22.14 25.14,21.84 25.14,21.77 v24.84,21.46
  Bottom 0.152: v26.95,12.4 26.65,12.7 26.65,17.01 25.44,18.22 25.44,19.93 24.84,20.53 v24.84,21.46 | v13.95,16.82 13.31,17.45 11.19,17.45 C12.2
  other vias: 10.59,16.85
PT100_AMP-  (via drill 0.35)
  Top 0.152: v27.43,13.2 27.43,13.63 23.72,17.35 16.38,17.35 arc0 14.67,17.35 arc-22 12.47,17.92 10.66,17.92 C12.1 10.16,17.85 10.14,17.83 9.47,17.83 C11.2 R11.1 | U4.5 27.2,23.89 25.74,22.43 25.74,22.02 25.44,21.71 v25.44,20.79
  Bottom 0.152: v27.43,13.2 27.43,13.63 26.98,14.09 26.98,17.11 25.74,18.34 25.74,20.48 v25.44,20.79
PT100_OUT  (via drill 0.35)
  Top 0.152: v7,24 7,23.11 7.25,22.86 7.25,22.46 7.61,22.1 8.82,22.1 8.95,22.06 9.72,21.29 C13.2 10.11,18.92 R15.1
  Bottom 0.152: v7,24 6.75,23.75 X1.12 X1.13 6.75,24.25 v7,24
PT100_R  (via drill 0.35)
  Top 0.152: v28.44,13.06 23.84,17.65 15,17.65 arc-39 11.64,18.84 11.64,18.88 R15.2 | U4.6 27.71,23.96 26.05,22.3 v26.05,21.46
  Bottom 0.152: v28.44,13.06 27.28,14.21 27.28,17.24 26.05,18.47 v26.05,21.46
PZ+  (via drill 0.35)
  Top 0.152: v34.31,30.89 34.31,28.27 PZ1.1 32.63,26.59 31.95,26.59 | 31.95,26.59 31.95,26.11 31.7,25.86 D8.3 | 31.95,26.59 31.61,26.93 30.3,26.93 | U4.12 30.03,26.66 30.3,26.93 | R19.2 30.3,27.6 30.3,26.93
  Bottom 0.152: PZ+.TP 34.01,30.89 v34.31,30.89
PZ_AMP_OUT  (via drill 0.35)
  Top 0.152: U4.15 v27.7,28.78 | v25.74,30.99 24.71,29.96 R13.1
  Bottom 0.152: v27.7,28.78 27.69,28.78 25.74,30.72 v25.74,30.99
RGB_VCC
  Top 0.152: D2.P$1 10.02,34.78 R8.2
RST  (via drill 0.35)
  Top 0.152: RST.TP 17.77,4.98 16.08,4.98 15.32,5.75 15.32,8.9 14.91,9.31 6.24,9.31 2.88,12.66 2.88,24.09 2.58,24.39 2.58,24.89 3.19,25.5 v3.19,25.55 | v19.91,28.45 19.85,28.39 U1.29
  Bottom 0.152: RST..TP 28.07,36.67 24.06,32.66 24.06,30.9 21.6,28.45 v19.91,28.45 16.91,28.45 15.42,26.96 14.99,26.96 14.79,26.75 X1.18 5.11,26.64 4.49,26.64 3.4,25.55 v3.19,25.55
  other vias: 18.43,4.32
SCL  (via drill 0.35)
  Top 0.152: U1.6 17.3,24.27 16.66,24.92 15.87,24.92 15.71,25.08 15.06,25.08 14.86,25.28 14.86,26.23 14.92,26.28 v14.92,28.17
  Bottom 0.152: X1.21 6.04,28.25 6.54,27.75 6.54,27.74 6.62,27.67 14.41,27.67 v14.92,28.17
SDA  (via drill 0.35)
  Top 0.152: U1.3 16.92,25.77 16.28,26.41 16.02,26.41 15.52,26.91 15.52,28.42 14.96,28.98 v14.96,29.1
  Bottom 0.152: X1.22 5.97,28.75 6.75,27.97 13.83,27.97 v14.96,29.1
SPI_MISO  (via drill 0.35)
  Top 0.152: v24.04,10.36 20.66,10.36 MISO.TP | v22.46,20.62 21.85,21.23 U1.16
  Bottom 0.152: v24.04,10.36 24.97,10.36 25.32,10.71 25.32,10.78 26.04,11.49 26.04,16.72 22.46,20.3 v22.46,20.62
  other vias: 18.43,8.13
SPI_MOSI  (via drill 0.35)
  Top 0.152: v24.72,10.96 23.68,10.96 23.38,10.66 20.53,10.66 18.63,8.76 18.21,8.76 17.82,8.38 17.82,7.52 MOSI.TP | v21.55,20.67 21.55,21.1 21.37,21.29 21.37,22.57 U1.15
  Bottom 0.152: v24.72,10.96 24.72,10.99 25.1,10.99 25.73,11.62 25.73,16.59 22.31,20.02 22.21,20.02 v21.55,20.67
  other vias: 16.52,6.22
SPI_SCK  (via drill 0.35)
  Top 0.152: v25.96,10.56 25.17,10.56 24.36,9.75 23.79,9.75 23.51,10.03 20.76,10.03 19.28,8.55 19.28,7.07 SCK.TP | v22.46,21.53 22.46,23.2 U1.17
  Bottom 0.152: v25.96,10.56 25.91,10.62 25.91,10.93 26.34,11.37 26.34,16.85 23.07,20.12 23.07,20.87 22.46,21.48 v22.46,21.53
  other vias: 18.43,6.22
SPI_SS
  Top 0.152: U1.14 20.85,22.16 20.96,22.05 20.96,21.23 SS.TP
TH0+
  Bottom 0.152: TH0.1 23.57,13.65 arc31 22.79,15.42 arc38 13.05,21.43 arc11 10.92,21.7 6.39,21.73 5.25,21.73 X1.8
TH0-
  Bottom 0.152: TH0.2 arc39 24.46,14.29 arc23 17.91,19.94 arc21 11.95,21.98 arc8 10.3,22.1 6.01,22.1 5.98,22.13 5.95,22.13 5.83,22.25 X1.9
TRG_LED
  Top 0.152: TRG.- 8.27,32.58 R6.2
TTL_RXD  (via drill 0.35)
  Top 0.152: v19.23,29.05 19.23,28.92 19.3,28.85 19.3,27.51 U1.30
  Bottom 0.152: RXD.TP 26.86,37.92 26.86,35.89 23.75,32.78 23.75,31.03 21.48,28.75 20.46,28.75 20.16,29.05 v19.23,29.05 18.93,28.75 16.79,28.75 15.29,27.26 14.87,27.26 14.66,27.06 6.36,27.06 6.16,27.25 X1.19
TTL_TXD  (via drill 0.35)
  Top 0.152: v18.32,29.36 18.32,29.23 18.62,28.93 18.62,28.8 18.85,28.58 U1.31
  Bottom 0.152: TXD.TP 25.48,39.07 25.48,38.06 26.55,36.98 26.55,36.02 23.45,32.91 23.45,31.15 21.35,29.06 20.59,29.06 20.28,29.36 19.78,29.36 19.48,29.66 18.98,29.66 18.67,29.36 v18.32,29.36 18.02,29.06 16.66,29.06 15.17,27.57 14.74,27.57 14.54,27.36 6.49,27.36 6.24,27.62 6.11,27.75 X1.20
V_FOL_PWM  (via drill 0.35)
  Top 0.152: U1.1 17.66,27.28 v17.67,27.29
  Bottom 0.152: v17.67,27.29 17.67,27 18.06,26.61 18.98,26.61 21.4,24.19 23.17,24.19 23.27,24.29 23.77,24.29 24.31,23.75 27.65,23.75 27.99,23.41 | 27.99,23.41 R10.2 | FOL_PWM.TP 27.99,23.24 27.99,23.41
  other vias: 28.9,22.5 27.6,22.85
V_FOLLOW  (via drill 0.35)
  Top 0.152: U4.7 U4.8 29.34,24.43 v29.36,24.45 | v29.39,27.34 29.08,27.64 29.08,29.42 28.94,29.55 R1.1 | U1.23 23.06,26.27 23.28,26.5 23.28,26.59 24.03,27.34 25.3,27.34 v25.6,27.04
  Bottom 0.152: v25.6,27.04 25.88,27.31 29.36,27.31 v29.39,27.34 29.39,26.91 29.36,26.89 v29.36,24.45
V_INT  (via drill 0.35)
  Top 0.152: C3.1 27.92,11.22 v27.92,11.34
  Top 0.508: v15.35,20.07 arc-45 13.77,20.73 11.78,22.72 arc-45 11.51,23.37 11.51,23.45 arc45 11.18,24.24 arc45 10.37,24.57 9.29,24.57 arc-45 8.64,24.84 8.48,25 arc45 8.05,25.18 J1.P$3 J1.P$2
  Bottom 0.152: FAN0.2 29.77,15.07
  Bottom 0.508: 29.77,15.07 30.75,14.1 | 30.75,14.1 30.75,14.07 29.6,12.92 29.51,12.92 v27.92,11.34 26.46,9.87 arc-138 21.46,11.87 arc1 21.46,14.87 arc44 21.04,15.87 20.14,16.77 arc21 v15.35,20.07 | 30.75,14.1 30.75,14.22 31.81,14.22 32.46,14.87 34.46,16.87 34.46,18.36 FAN1.2
VCC
  Top 0.152: J1.P$13 5.09,15.11
  Top 0.508: J1.P$11 J1.P$10 | J1.P$12 5.09,15.11 J1.P$14
  Top 1.27: J1.P$11 5.09,15.11 J1.P$15 arc90 6.78,11.49 HE0.1 HE0.2
VCC_REG  (via drill 0.35)
  Top 0.152: 5V.TP 15.04,9.61 6.36,9.61 3.19,12.79 v3.19,24.64 | 11.93,16.38 R12.2 11.91,16.02 C8.2 | 11.93,16.38 11.93,16.92 C10.2 | C2.2 13.61,26.43 13.34,26.43 | v13.61,12.91 13.61,15.27 v13.66,15.32 | v11.96,16.47 11.96,16.41 11.93,16.38
  Top 0.508: v8.53,26.15 8.65,26.02 8.65,25.82 9.19,25.28 11.51,25.28 12.6,26.37 D1.P$2 13.34,26.43 F1.1
  Bottom 0.152: 5.73,26.04 5.6,25.91 arc-45 X1.16 4.31,25.75 v3.19,24.64 | 5V.TP 13.61,11.04 v13.61,12.91 | v13.66,15.32 12.51,16.47 v11.96,16.47
  Bottom 0.305: X1.17 5.45,26.04
  Bottom 0.508: v8.53,26.15 8.41,26.04 5.73,26.04 5.45,26.04
  other vias: 16.52,8.13
VCOMP_PWM  (via drill 0.35)
  Top 0.152: U1.13 v20.35,21.8 20.08,21.53 COMP_PWM.TP | v24.13,23.01 24.53,23.41 v24.53,24.39
  Bottom 0.152: v20.35,21.8 21.56,23.01 v24.13,23.01 | v24.53,24.39 23.9,25.02 23.9,28.55 v24.12,28.78
VCOMP_SENSE  (via drill 0.35)
  Top 0.152: U1.24 23.04,26.77 R5.1 24.15,27.82 C6.2 25.92,27.82 C7.2 26.09,27.86 | 26.09,27.86 26.37,27.57 26.46,27.57 26.48,27.55 U4.1 | v30.19,32.21 29.71,31.73 28.07,31.73 27.54,31.21 27.54,29.9 26.79,29.16 26.79,28.56 26.09,27.86
  Bottom 0.152: VCOM.TP 35.23,28.36 34.29,29.3 33.87,29.3 33.53,29.64 32.68,29.64 30.19,32.13 v30.19,32.21
VREF_IN  (via drill 0.35)
  Top 0.152: C5.2 28.29,22.11 28.29,22.75 28.69,23.15 R10.1 30.09,23.69 C4.2 30.25,24.64 29.73,25.16 U4.9 29.82,25.16 v30.57,25.91 | FOL.TP 31.62,32.57 31.89,32.3 32.24,32.3 33.11,31.44 33.11,30.93 33.51,30.53 33.51,30.02 33.16,29.67 32.65,29.67 32.57,29.75 32.37,29.75 31.69,29.07 30.74,29.07 30.53,29.28 v30.1,29.28
  Bottom 0.152: v30.1,29.28 29.8,28.97 29.8,28.22 30.3,27.72 30.3,26.96 29.97,26.63 29.97,26.22 30.28,25.91 v30.57,25.91
  other vias: 31.62,33.21
X_1A
  Bottom 0.305: X1.28 X1.27
X_1B
  Bottom 0.305: X1.30 X1.29
X_2A
  Bottom 0.305: X1.26 X1.25
X_2B
  Bottom 0.305: X1.24 X1.23
Z_MIN_TRIG  (via drill 0.35)
  Top 0.152: v10.37,23.7 10.37,23.35 10.64,23.07 13.65,20.07 13.67,20.07 arc40 15.81,19.42 18.41,19.42 arc90 19.38,20.39 19.38,22.56 U1.11 | v10.3,26.06 10.3,26.54 8.23,28.61 R6.1 8.23,31.79 8.94,32.5 8.94,35.42 D2.P$4
  Bottom 0.152: v10.3,26.06 10.37,26 v10.37,23.7 9.55,24.51 arc45 7.76,25.25 X1.15
Z_TRG
  Top 0.152: U1.32 18.35,28.47 17.71,29.11 17.71,29.61 18.07,29.97 18.57,29.97 18.58,29.96 R13.2 19.39,29.97 19.39,30.37 INT.TP

### Text on the board
tPlace: + -
bPlace: 2B 2A 1A 1B | + - | PZ1 | Fan1 | + - | Fan0 | + - | HE0 | + - | TH0